# EAGLE design Bluetooth BM20 Breakout (EAGLE 9.6.2)
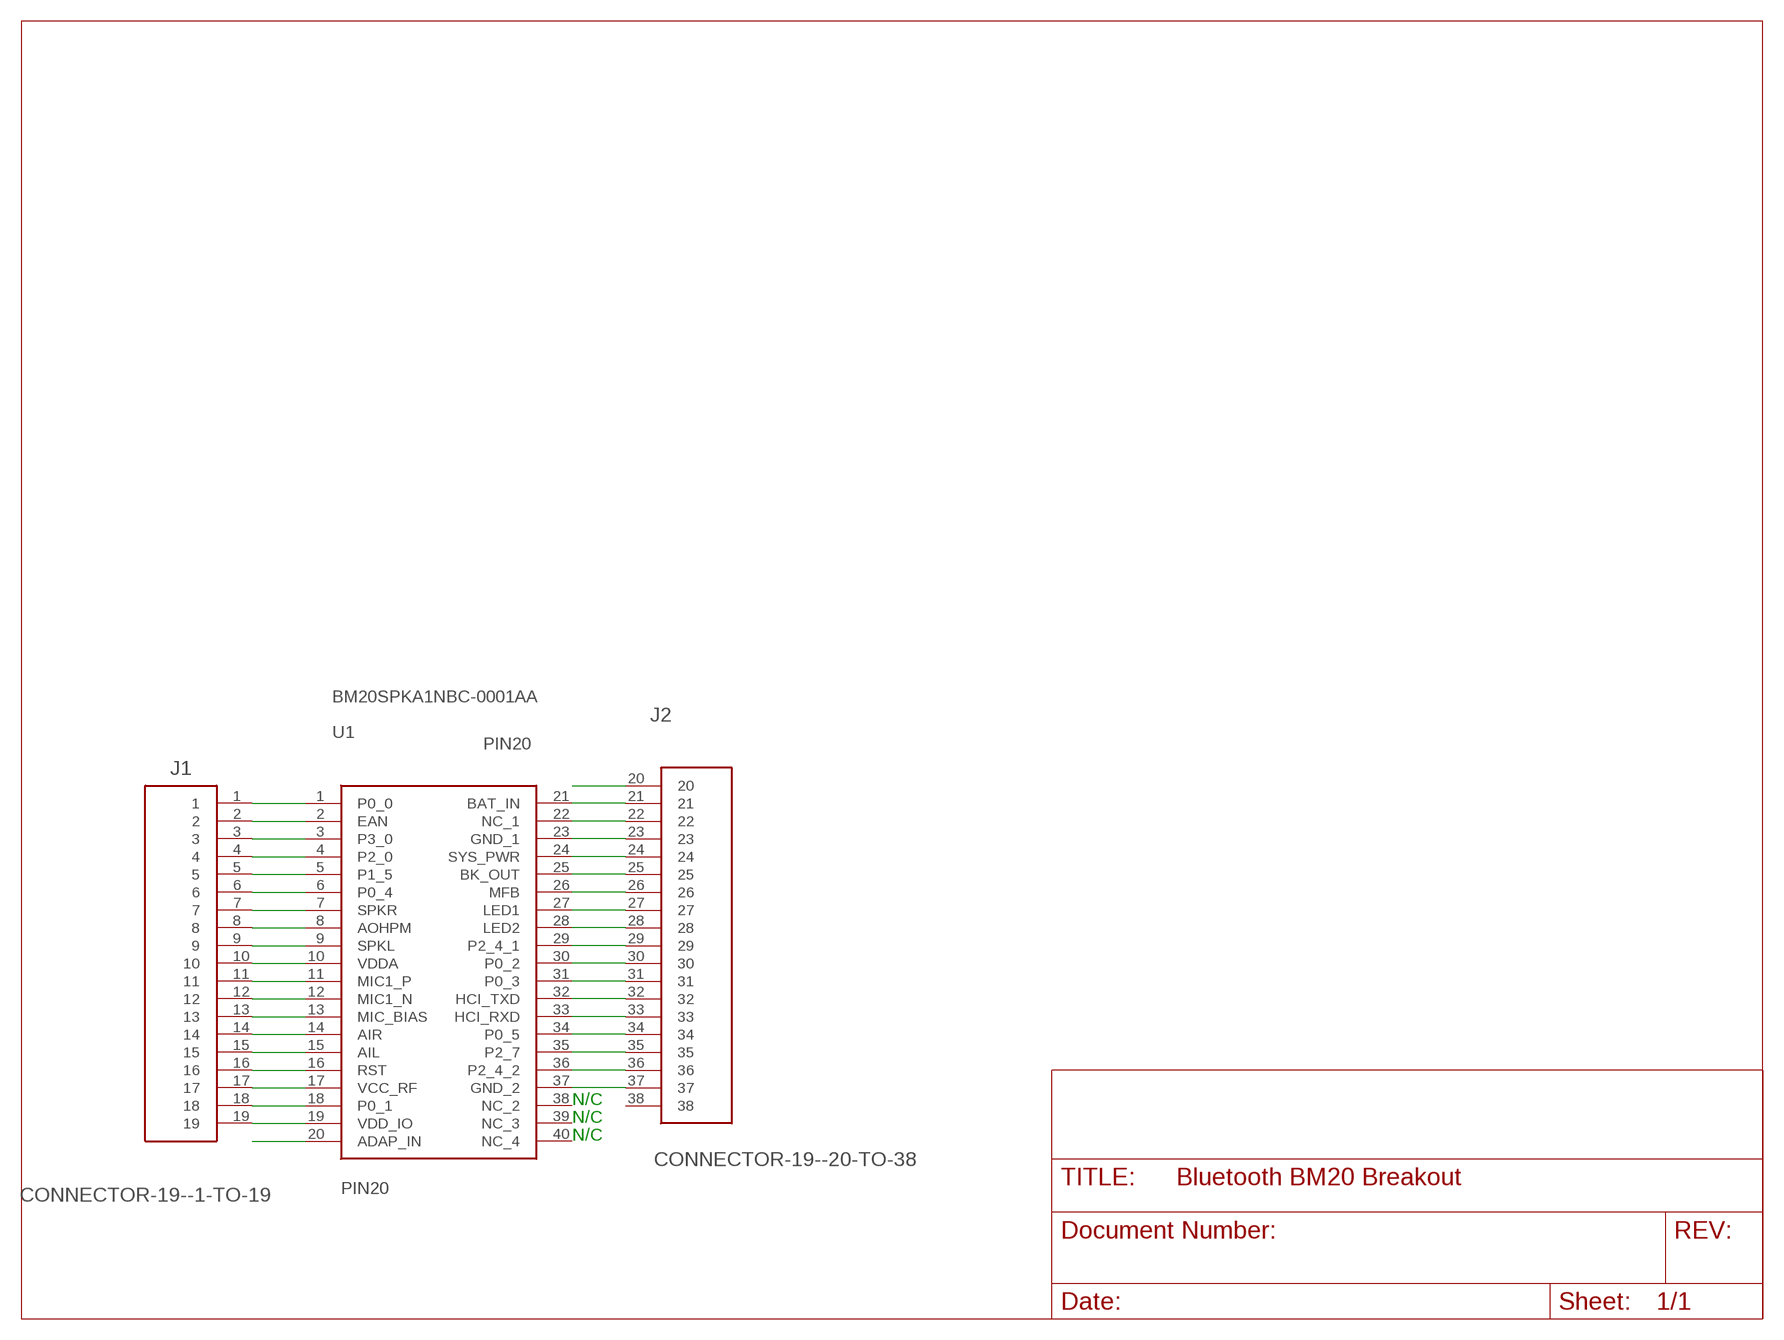
[diagram p0: schematic, sheet 1]

## Parts
J1  CONNECTOR-19--1-TO-19  [ESQ-119-XX-XX-S]
J2  CONNECTOR-19--20-TO-38  [ESQ-119-XX-XX-S--PIN-1-ROUND]
U1  BM20SPKA1NBC-0001AA  [BM20SPKA1NBC0001AA]

## Nets
N$1: J2.23 U1.23(GND_1)
N$2: J2.24 U1.24(SYS_PWR)
N$3: J2.21 U1.21(BAT_IN)
N$4: J2.25 U1.25(BK_OUT)
N$5: J2.22 U1.22(NC_1)
N$6: J2.26 U1.26(MFB)
N$7: J2.27 U1.27(LED1)
N$8: J2.28 U1.28(LED2)
N$9: J2.29 U1.29(P2_4_1)
N$10: J2.30 U1.30(P0_2)
N$11: J2.31 U1.31(P0_3)
N$12: J2.32 U1.32(HCI_TXD)
N$13: J2.33 U1.33(HCI_RXD)
N$14: J2.34 U1.34(P0_5)
N$15: J2.35 U1.35(P2_7)
N$16: J2.36 U1.36(P2_4_2)
N$17: J2.37 U1.37(GND_2)
N$19: J1.4 U1.4(P2_0)
N$20: J1.1 U1.1(P0_0)
N$21: J1.5 U1.5(P1_5)
N$22: J1.2 U1.2(EAN)
N$23: J1.6 U1.6(P0_4)
N$24: J1.3 U1.3(P3_0)
N$25: J1.7 U1.7(SPKR)
N$26: J1.8 U1.8(AOHPM)
N$27: J1.9 U1.9(SPKL)
N$28: J1.10 U1.10(VDDA)
N$29: J1.11 U1.11(MIC1_P)
N$30: J1.12 U1.12(MIC1_N)
N$31: J1.13 U1.13(MIC_BIAS)
N$32: J1.14 U1.14(AIR)
N$33: J1.15 U1.15(AIL)
N$34: J1.16 U1.16(RST)
N$35: J1.17 U1.17(VCC_RF)
N$36: J1.18 U1.18(P0_1)
N$37: J1.19 U1.19(VDD_IO)
PIN20: J2.20 U1.20(ADAP_IN)
Unconnected: J2.38 U1.38(NC_2) U1.39(NC_3) U1.40(NC_4)

## Notes on the sheet
- N/C
- N/C
- N/C

## Library data of the parts
J1 = eagle-library-engr-245-s22:CONNECTOR-19--1-TO-19
J2 = eagle-library-engr-245-s22:CONNECTOR-19--20-TO-38
U1 = eagle-library-engr-245-s22:BM20SPKA1NBC-0001AA: Bluetooth Modules (802.15.1) BT 4.1 Stereo Audio No-Shield/Antenna Source: Datasheet <https://componentsearchengine.com/Datasheets/1/BM20SPKA1NBC-0001AA.pdf>; DESCRIPTION: Bluetooth Modules (802.15.1) BT 4.1 Stereo Audio No-Shield/Antenna; HEIGHT: 2.5mm; MANUFACTURER_NAME: Microchip; MANUFACTURER_PART_NUMBER: BM20SPKA1NBC-0001AA; MOUSER_PART_NUMBER: 579-SPKA1NBC-0001AA; MOUSER_PRICE-STOCK: https://www.mouser.co.uk/ProductDetail/Microchip-Technology/BM20SPKA1NBC-0001AA?qs=uus7iwvxYD8HqvnWsd76VQ%3D%3D

## Board
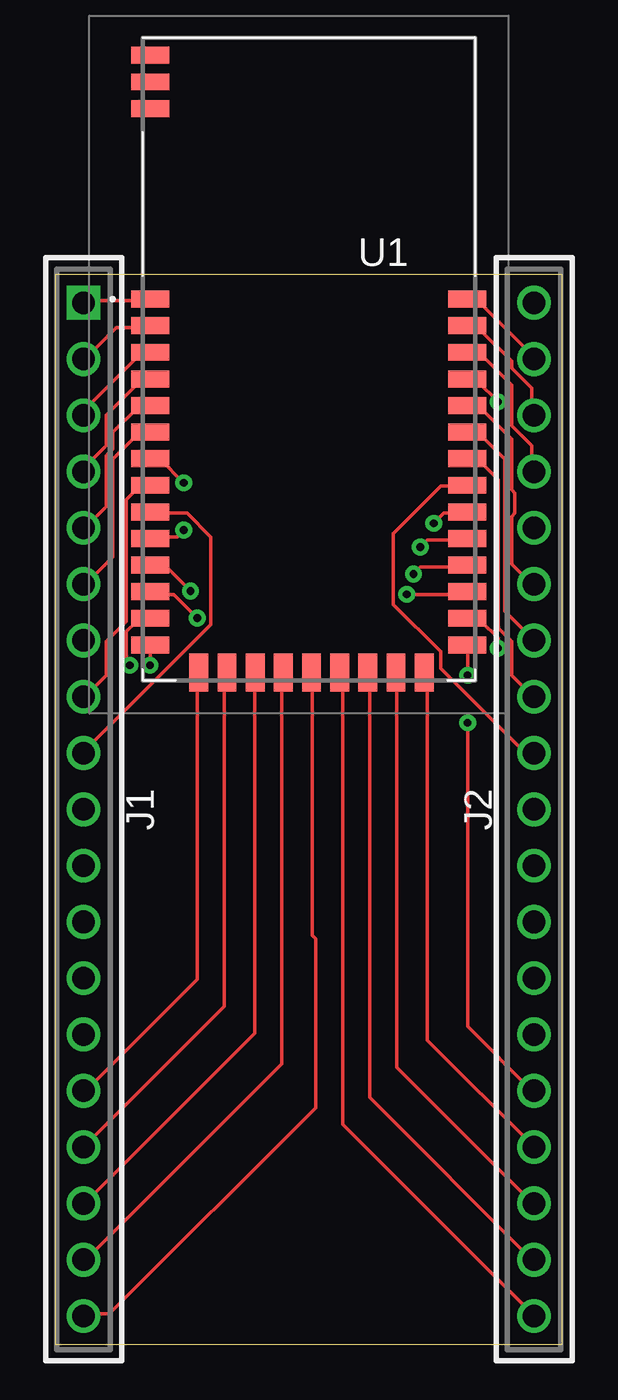
[diagram p1: board, top side]
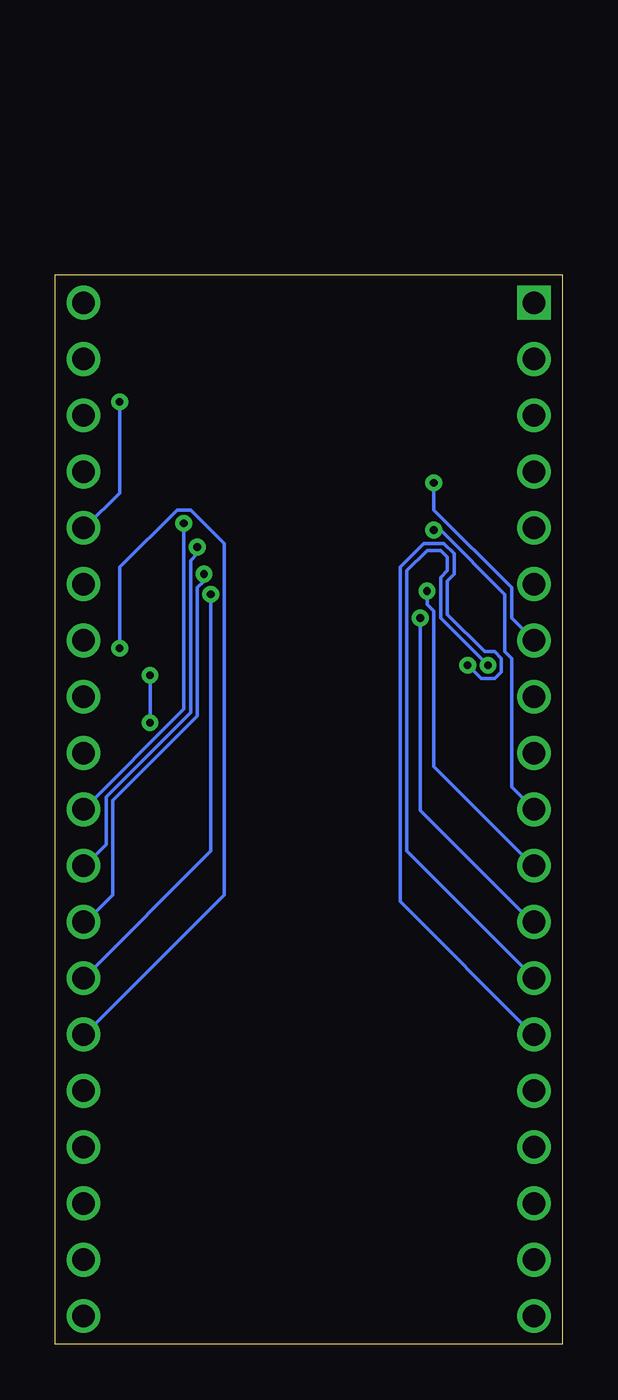
[diagram p2: board, bottom side, seen from below]

Size 22.86 x 48.26 mm. Coordinates in mm from the lower left corner, seen from the top.
Outline: 0,0 22.86,0 22.86,48.26 0,48.26 0,0
Copper layers (1*16): Top 0.035mm / dielectric 1.5mm / Bottom 0.035mm
Design rules "default": minimum track width 6mil, minimum drill 0.35mm, track to track 6mil, track to pad 6mil, pad to pad 6mil, via to via 6mil, smd to smd 6mil, copper to edge 40mil, drill to drill 6mil, minimum pad ring 10mil, minimum via ring 8mil, stop-mask expansion 4mil, vias tented up to drill 0mil, thermal gap 10mil

### Footprints (pad centres in the part's own frame; a part is rotated, then mirrored left to right if it is on the bottom)
ESQ-119-XX-XX-S = drill 1.016 pad 1.524 square: 1 0,0 | drill 1.016 pad 1.524: 2 2.54,0; 3 5.08,0; 4 7.62,0; 5 10.16,0; 6 12.7,0; 7 15.24,0; 8 17.78,0; 9 20.32,0; 10 22.86,0; 11 25.4,0; 12 27.94,0; 13 30.48,0; 14 33.02,0; 15 35.56,0; 16 38.1,0; 17 40.64,0; 18 43.18,0; 19 45.72,0
ESQ-119-XX-XX-S--PIN-1-ROUND = drill 1.016 pad 1.524: 20 -22.86,0; 21 -20.32,0; 22 -17.78,0; 23 -15.24,0; 24 -12.7,0; 25 -10.16,0; 26 -7.62,0; 27 -5.08,0; 28 -2.54,0; 29 0,0; 30 2.54,0; 31 5.08,0; 32 7.62,0; 33 10.16,0; 34 12.7,0; 35 15.24,0; 36 17.78,0; 37 20.32,0; 38 22.86,0
BM20SPKA1NBC0001AA = smd 1.7 x 0.76: 1 -7.15,2.7; 2 -7.15,1.5; 3 -7.15,0.3; 4 -7.15,-0.9; 5 -7.15,-2.1; 6 -7.15,-3.3; 7 -7.15,-4.5; 8 -7.15,-5.7; 9 -7.15,-6.9; 10 -7.15,-8.1; 11 -7.15,-9.3; 12 -7.15,-10.5; 13 -7.15,-11.7; 14 -7.15,-12.9; 24 7.15,-12.9; 25 7.15,-11.7; 26 7.15,-10.5; 27 7.15,-9.3; 28 7.15,-8.1; 29 7.15,-6.9; 30 7.15,-5.7; 31 7.15,-4.5; 32 7.15,-3.3; 33 7.15,-2.1; 34 7.15,-0.9; 35 7.15,0.3; 36 7.15,1.5; 37 7.15,2.7; 38 -7.15,13.7; 39 -7.15,12.5; 40 -7.15,11.3 | smd 0.85 x 1.7: 15 -4.96,-14.15; 16 -3.69,-14.15; 17 -2.42,-14.15; 18 -1.15,-14.15; 19 0.12,-14.15; 20 1.39,-14.15; 21 2.66,-14.15; 22 3.93,-14.15; 23 5.2,-14.15

### Placement (x,y rotation side)
J1  1.27,46.99 270 top
J2  21.59,24.13 90 top
U1  11.43,44.45 0 top

### Tracks (layer width: path | path; a pad name or v marks a point on that pad's centre or on a via)
N$1
  Top 0.152: J2.23 16.76,13.72 16.76,30.18 U1.23
N$2  (via drill 0.35)
  Top 0.152: v18.59,30.18 18.59,31.55 U1.24 | v18.59,28.04 18.59,14.33 21.49,11.43 J2.24
  Bottom 0.152: v18.59,28.04 v18.59,30.18
N$3
  Top 0.152: U1.21 14.17,30.18 14.17,11.12 21.49,3.81 J2.21
N$4  (via drill 0.35)
  Top 0.152: v19.96,31.39 19.96,31.85 19.2,32.61 18.59,32.61 U1.25
  Bottom 0.152: v19.96,31.39 19.96,35.05 17.37,37.64 16.76,37.64 15.24,36.12 15.24,20.27 21.49,14.02 J2.25
N$5
  Top 0.152: U1.22 15.39,30.18 15.39,12.5 21.49,6.4 J2.22
N$6  (via drill 0.35)
  Top 0.152: v15.85,33.83 18.44,33.83 U1.26
  Bottom 0.152: v15.85,33.83 15.85,22.25 J2.26
N$7  (via drill 0.35)
  Top 0.152: v16.15,34.75 16.46,35.05 18.44,35.05 U1.27
  Bottom 0.152: v16.15,34.75 16.15,34.44 16.46,34.14 16.46,28.35 20.27,24.54 20.27,20.27 21.49,19.05 J2.27
N$8  (via drill 0.35)
  Top 0.152: v16.46,35.97 16.76,36.27 18.44,36.27 U1.28
  Bottom 0.152: v16.46,35.97 16.46,35.66 16.76,35.36 16.76,28.5 20.57,24.69 20.57,22.55 21.49,21.64 J2.28
N$9  (via drill 0.35)
  Top 0.152: v17.07,37.03 17.53,37.49 18.44,37.49 U1.29
  Bottom 0.152: v17.07,37.03 17.07,28.65 J2.29
N$10
  Top 0.152: J2.30 21.18,26.67 17.37,30.48 17.37,31.24 15.24,33.38 15.24,36.58 17.37,38.71 18.44,38.71 U1.30
N$11
  Top 0.152: U1.31 18.59,39.93 19.05,39.93 19.96,39.01 19.96,32.31 20.57,31.7 20.57,30.18 21.49,29.26 J2.31
N$12
  Top 0.152: J2.32 20.27,33.07 20.27,39.93 19.05,41.15 18.59,41.15 U1.32
N$13
  Top 0.152: U1.33 18.59,42.22 19.2,42.22 20.57,40.84 20.57,38.56 20.73,38.41 20.73,37.49 20.57,37.34 20.57,35.2 21.49,34.29 J2.33
N$14  (via drill 0.35)
  Top 0.152: v19.96,42.52 19.05,43.43 18.59,43.43 U1.34
  Bottom 0.152: v19.96,42.52 19.96,38.41 21.49,36.88 J2.34
N$15
  Top 0.152: U1.35 18.59,44.65 19.2,44.65 20.57,43.28 20.57,41.45 21.49,40.54 21.49,39.47 J2.35
N$16
  Top 0.152: U1.36 18.59,45.87 19.05,45.87 20.57,44.35 20.57,44.04 21.49,43.13 21.49,41.91 J2.36
N$17
  Top 0.152: U1.37 18.59,47.09 19.05,47.09 21.64,44.5 J2.37
N$19
  Top 0.152: U1.4 4.27,43.43 3.81,43.43 2.29,41.91 2.29,40.54 1.22,39.47 J1.4
N$20
  Top 0.152: U1.1 4.27,47.09 1.37,47.09 J1.1
N$21
  Top 0.152: U1.5 4.27,42.22 3.66,42.22 2.59,41.15 2.59,40.39 2.29,40.08 2.29,37.8 1.37,36.88 J1.5
N$22
  Top 0.152: U1.2 4.27,45.87 2.74,45.87 1.37,44.5 J1.2
N$23
  Top 0.152: U1.6 4.27,41.15 3.81,41.15 2.59,39.93 2.59,35.51 1.37,34.29 J1.6
N$24
  Top 0.152: U1.3 4.27,44.65 3.81,44.65 1.37,42.22 1.37,41.91 J1.3
N$25  (via drill 0.35)
  Top 0.152: v5.79,38.86 4.72,39.93 4.42,39.93 U1.7
  Bottom 0.152: v5.79,38.86 5.79,37.64 2.29,34.14 2.29,32.77 J1.7
N$26
  Top 0.152: U1.8 4.27,38.71 3.81,38.71 3.2,38.1 3.2,32.61 2.29,31.7 2.29,30.18 1.37,29.26 J1.8
N$27
  Top 0.152: U1.9 4.42,37.49 5.94,37.49 7.01,36.42 7.01,32.46 1.22,26.67 J1.9
N$28  (via drill 0.35)
  Top 0.152: v5.79,36.73 5.49,36.42 4.42,36.42 U1.10
  Bottom 0.152: v5.79,36.73 5.49,36.73 2.59,33.83 2.59,31.24 2.29,30.94 2.29,25.15 J1.10
N$29  (via drill 0.35)
  Top 0.152: v6.1,33.98 5.03,35.05 4.42,35.05 U1.11
  Bottom 0.152: v6.1,33.98 6.1,33.38 5.79,33.07 5.79,26.06 1.37,21.64 J1.11
N$30  (via drill 0.35)
  Top 0.152: v6.4,32.77 5.33,33.83 4.42,33.83 U1.12
  Bottom 0.152: v6.4,32.77 6.4,24.08 1.37,19.05 J1.12
N$31  (via drill 0.35)
  Top 0.152: v3.35,30.63 3.2,30.79 3.2,32.16 3.66,32.61 4.27,32.61 U1.13
  Bottom 0.152: v3.35,30.63 5.49,32.77 5.49,34.59 5.18,34.9 5.18,35.51 5.49,35.81 6.1,35.81 7.01,34.9 7.01,22.25 J1.13
N$32  (via drill 0.35)
  Top 0.152: v4.27,30.63 4.27,31.55 U1.14
  Bottom 0.152: v4.27,30.63 3.66,30.02 3.05,30.02 2.74,30.33 2.74,30.94 3.05,31.24 3.5,31.24 5.18,32.92 5.18,34.44 4.88,34.75 4.88,35.66 5.33,36.12 6.25,36.12 7.32,35.05 7.32,19.96 1.37,14.02 J1.14
N$33
  Top 0.152: U1.15 6.4,30.18 6.4,16.46 1.37,11.43 J1.15
N$34
  Top 0.152: J1.16 7.62,15.24 7.62,30.18 U1.16
N$35
  Top 0.152: U1.17 8.99,30.18 8.99,14.02 1.37,6.4 J1.17
N$36
  Top 0.152: U1.18 10.21,30.18 10.21,12.65 1.37,3.81 J1.18
N$37
  Top 0.152: U1.19 11.58,30.18 11.58,18.44 11.73,18.29 11.73,10.67 2.44,1.37 1.37,1.37 J1.19
PIN20
  Top 0.152: J2.20 12.95,9.91 12.95,30.18 U1.20